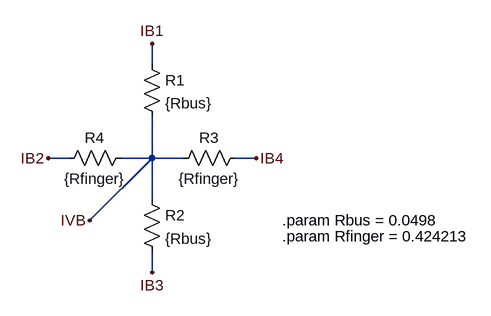
[diagram p0: schematic IVBottomElementIso.asc]
IVBottomElementIso.asc, the LTspice schematic file:
Version 4
SHEET 1 880 680
WIRE 176 48 176 16
WIRE 48 192 16 192
WIRE 176 192 176 128
WIRE 176 192 128 192
WIRE 224 192 176 192
WIRE 336 192 304 192
WIRE 176 256 176 192
WIRE 80 288 176 192
WIRE 176 368 176 336
FLAG 176 16 IB1
FLAG 16 192 IB2
FLAG 176 368 IB3
FLAG 336 192 IB4
FLAG 80 288 IVB
SYMBOL res 160 32 R0
SYMATTR InstName R1
SYMATTR Value {Rbus}
SYMBOL res 160 240 R0
SYMATTR InstName R2
SYMATTR Value {Rbus}
SYMBOL res 320 176 R90
WINDOW 0 0 56 VBottom 2
WINDOW 3 32 56 VTop 2
SYMATTR InstName R3
SYMATTR Value {Rfinger}
SYMBOL res 144 176 R90
WINDOW 0 0 56 VBottom 2
WINDOW 3 32 56 VTop 2
SYMATTR InstName R4
SYMATTR Value {Rfinger}
TEXT 376 288 Left 2 !.param Rbus = 0.0498
TEXT 376 312 Left 2 !.param Rfinger = 0.424213

The netlist it stands for:
* IVBottomElementIso.asc
R1 IB1 IVB {Rbus}
R2 IVB IB3 {Rbus}
R3 IB4 IVB {Rfinger}
R4 IVB IB2 {Rfinger}
.param Rbus = 0.0498
.param Rfinger = 0.424213
.backanno
.end